# EasyEDA schematic SCH_555CircuitWorking_2024-04-29.json
TITLE: Sheet_1; REV: 1.0; Date: 2024-04-22; Sheet: 1/1; Drawn By: adagar; Company: Your Company
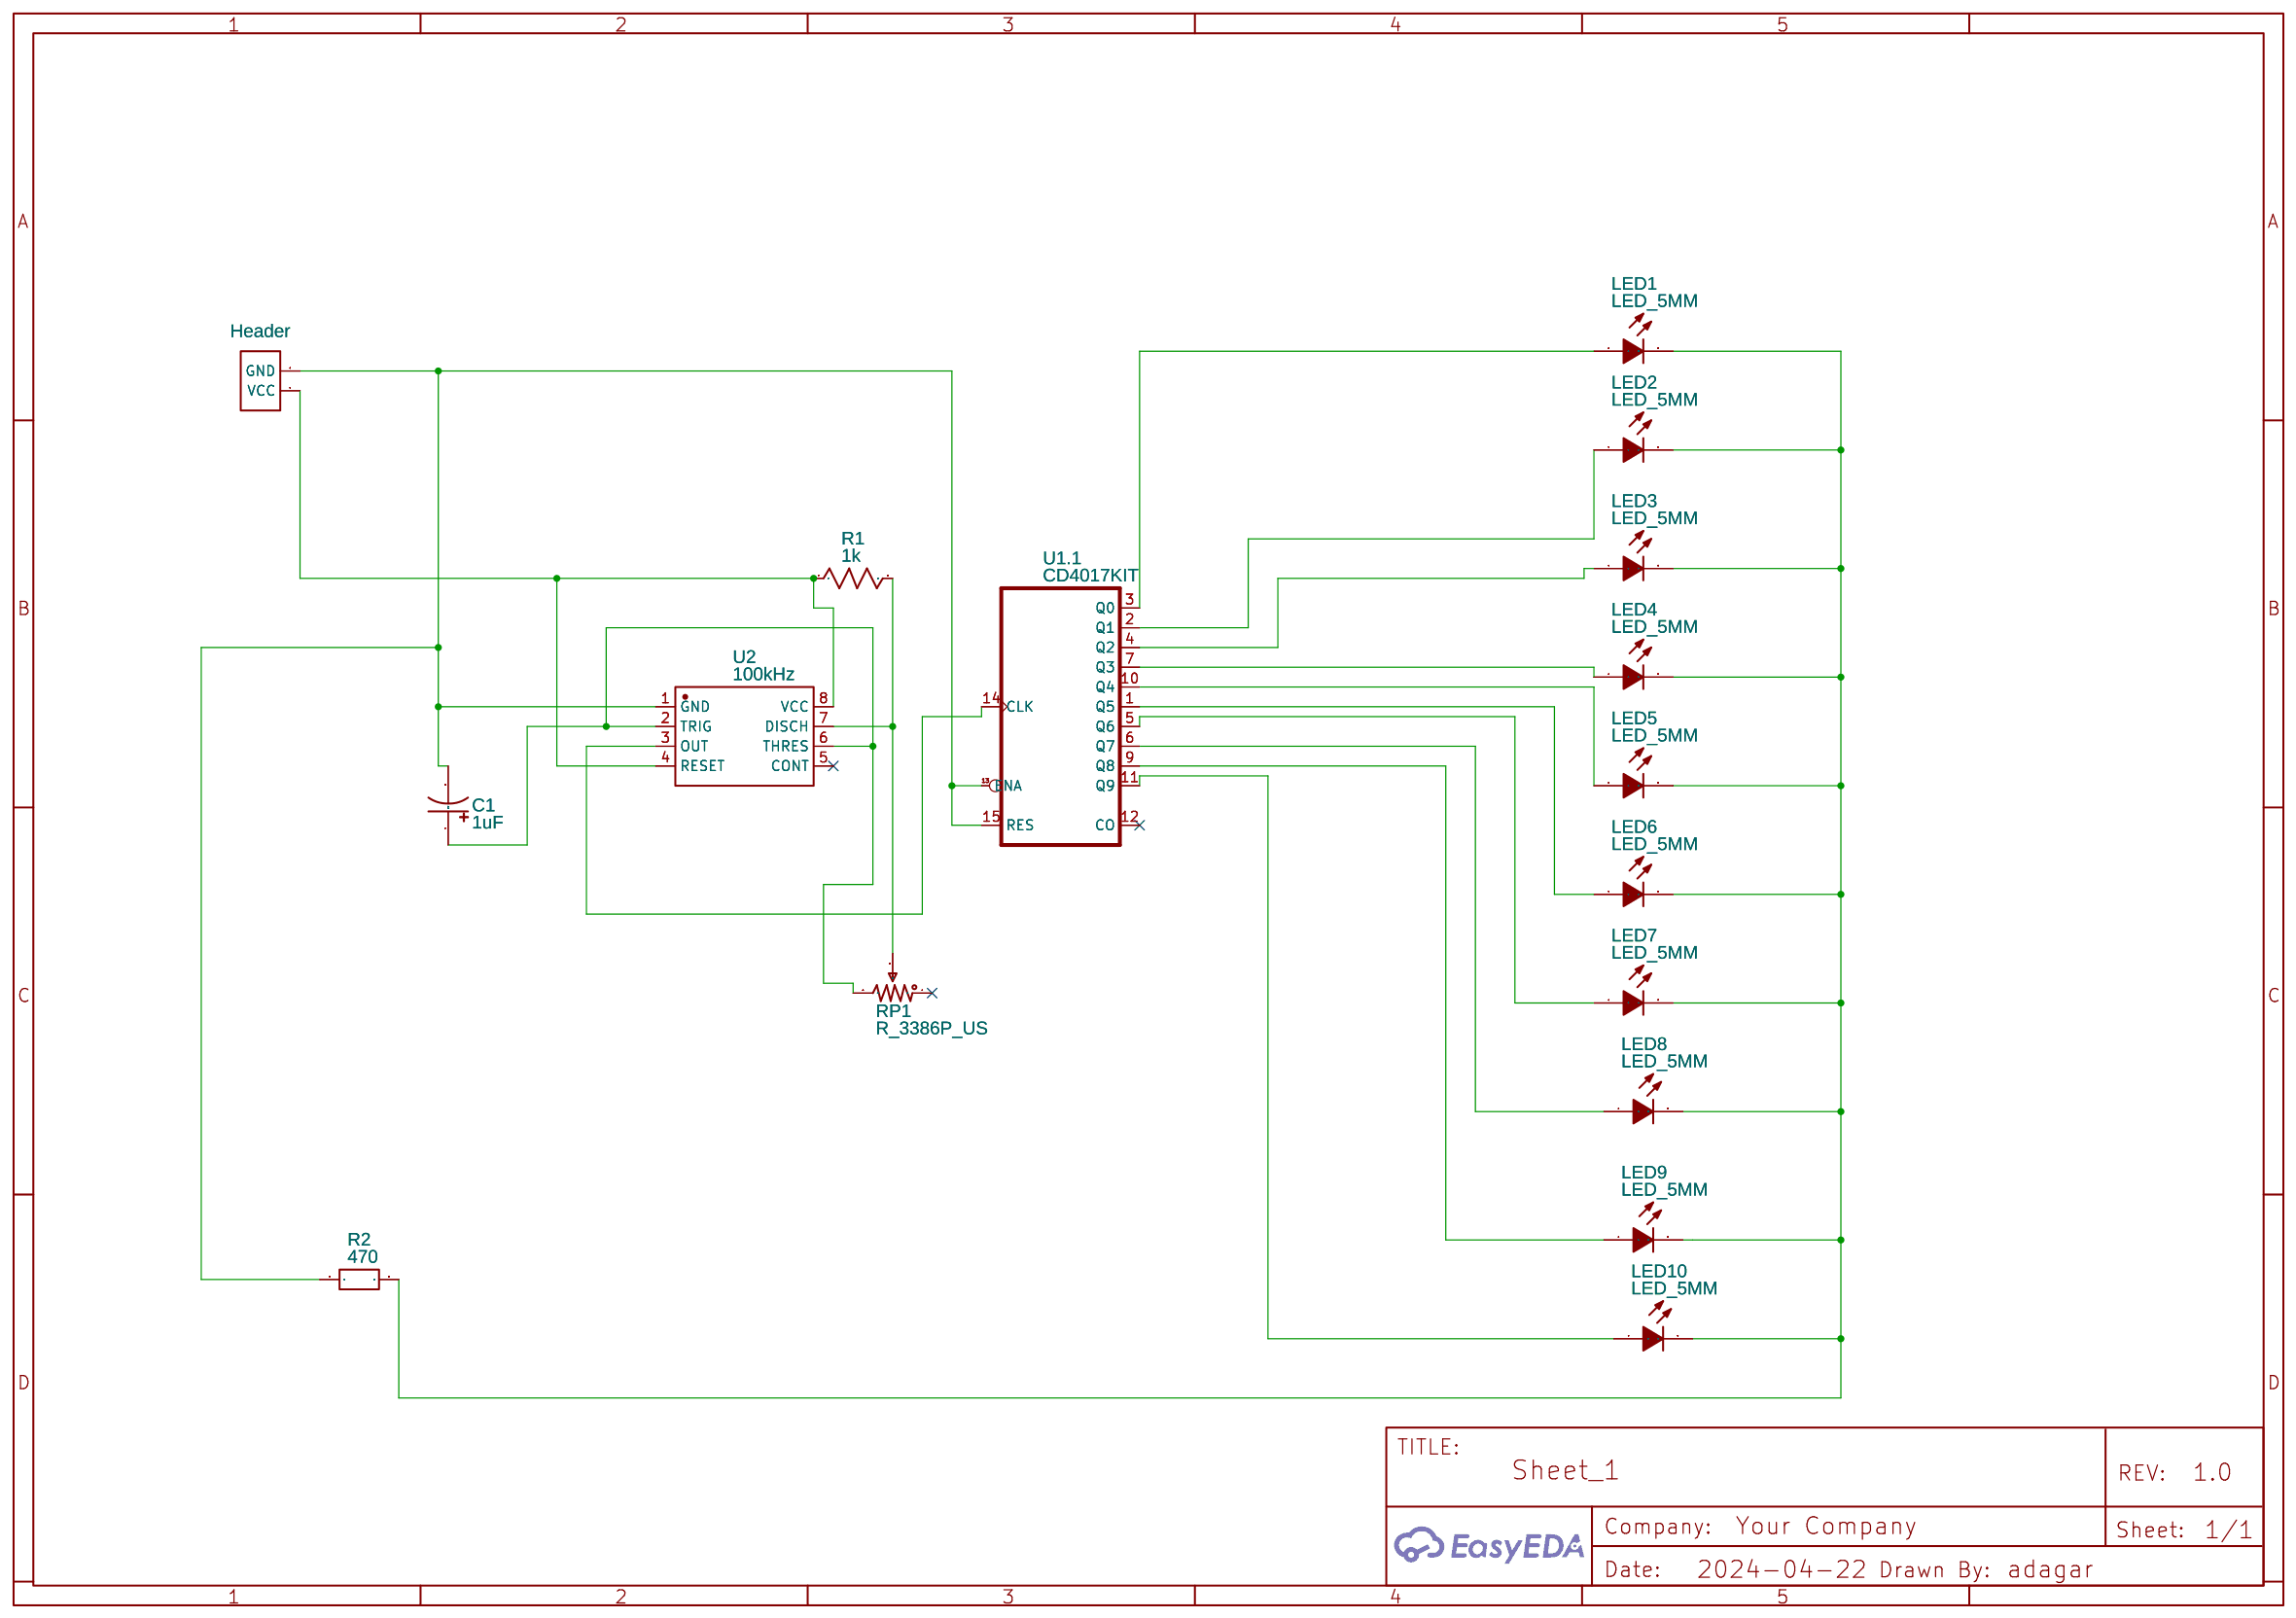
[diagram p0: schematic sheet]

## Parts
C1  1uF  [CAP-TH_BD5.0-P2.00-D0.8-FD]
H1  Header  [HEADER-FEMALE-2.54_1X2]
LED1  LED_5MM  [LED-TH_BD5.0-P2.54-FD_C9900023552]
LED2  LED_5MM  [LED-TH_BD5.0-P2.54-FD_C9900023552]
LED3  LED_5MM  [LED-TH_BD5.0-P2.54-FD_C9900023552]
LED4  LED_5MM  [LED-TH_BD5.0-P2.54-FD_C9900023552]
LED5  LED_5MM  [LED-TH_BD5.0-P2.54-FD_C9900023552]
LED6  LED_5MM  [LED-TH_BD5.0-P2.54-FD_C9900023552]
LED7  LED_5MM  [LED-TH_BD5.0-P2.54-FD_C9900023552]
LED8  LED_5MM  [LED-TH_BD5.0-P2.54-FD_C9900023552]
LED9  LED_5MM  [LED-TH_BD5.0-P2.54-FD_C9900023552]
LED10  LED_5MM  [LED-TH_BD5.0-P2.54-FD_C9900023552]
R1  1k  [R0603]
R2  470  [R0603]
RP1  R_3386P_US  [RES-ADJ-TH_3386P]
U1  CD4017KIT  [DIL16-KIT]  (section 1)
U2  100kHz  [DIP-8_L9.8-W6.6-P2.54-LS7.6-BL]

## Library data of the parts
C1 = UVZ1H010MDD: Contributor: LCSC; Supplier: LCSC; Supplier Part: C62934; Manufacturer: Nichicon(尼吉康); JLCPCB Part Class: Extended Part
H1 = HEADER-FEMALE-2.54_1X2: Contributor: nonstop2004; Supplier: LCSC; Supplier Part: C492401
LED1-LED10 = LED_5MM: Contributor: lcsc; Supplier: LCSC; Supplier Part: C2992663; Manufacturer: null; JLCPCB Part Class: Extended Part
R1 = R_0603_US: Supplier Part: C713997; Supplier: LCSC; Contributor: LCEDA_Lib
R2 = R_0603_EU: Supplier Part: C58592; Supplier: LCSC; Contributor: LCEDA_Lib
RP1 = R_3386P_US: Supplier Part: C118912; Supplier: LCSC; Contributor: LCEDA_Lib; value(Ω): 50K
U1 = CD4017KIT: Contributor: SparkFun; subpart_no: 1; Supplier: LCSC; Supplier Part: C34519
U2 = NE555P: Supplier: LCSC; Manufacturer: TI(德州仪器); Supplier Part: C46749; JLCPCB Part Class: Extended Part

## Nets
Net-(C1-1): C1.1 RP1.3 U2.2(TRIG) U2.6(THRES)
Net-(C1-2): C1.2 H1.2(GND) R2.1 U1.13(ENA) U1.15(RES) U2.1(GND)
Net-(H1-1): H1.1(VCC) R1.1 U2.4(RESET) U2.8(VCC)
Net-(LED1-1): LED1.1(A) U1.3(Q0)
Net-(LED1-2): LED1.2(K) LED2.2(K) LED3.2(K) LED4.2(K) LED5.2(K) LED6.2(K) LED7.2(K) LED8.2(K) LED9.2(K) LED10.2(K) R2.2
Net-(LED2-1): LED2.1(A) U1.2(Q1)
Net-(LED3-1): LED3.1(A) U1.4(Q2)
Net-(LED4-1): LED4.1(A) U1.7(Q3)
Net-(LED5-1): LED5.1(A) U1.10(Q4)
Net-(LED6-1): LED6.1(A) U1.1(Q5)
Net-(LED7-1): LED7.1(A) U1.5(Q6)
Net-(LED8-1): LED8.1(A) U1.6(Q7)
Net-(LED9-1): LED9.1(A) U1.9(Q8)
Net-(LED10-1): LED10.1(A) U1.11(Q9)
Net-(R1-2): R1.2 RP1.2 U2.7(DISCH)
Net-(U1.1-14): U1.14(CLK) U2.3(OUT)

Not connected (* = marked no-connect by the designer): RP1 1*; U1 12(CO)*; U2 5(CONT)*
